# Altium schematic sheet AUV maincontrol.SchDoc
size A4; SheetNumber: 1; SheetTotal: 6
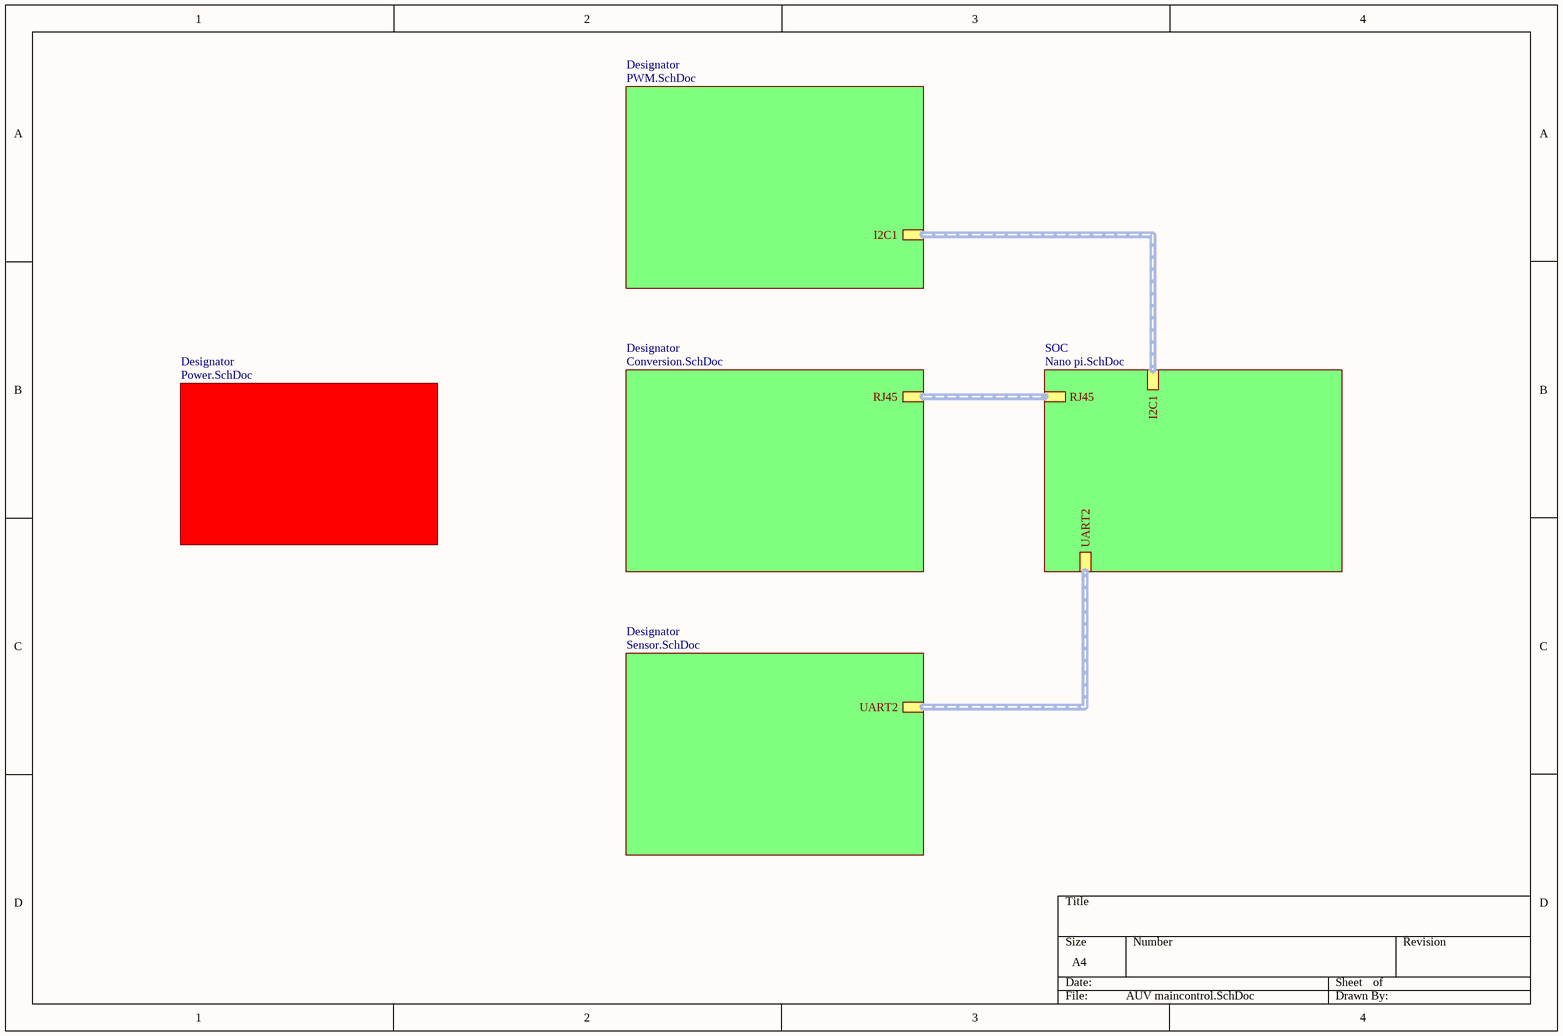
[diagram p0: AUV maincontrol.SchDoc]

## Sub-sheets
Designator = Power.SchDoc: no entries
Designator = Conversion.SchDoc: RJ45
Designator = PWM.SchDoc: I2C1
Designator = Sensor.SchDoc: UART2
SOC = Nano pi.SchDoc: RJ45, UART2, I2C1

## Buses and harness runs
harness sheet Designator/I2C1 = sheet SOC/I2C1
harness sheet Designator/RJ45 = sheet SOC/RJ45
harness sheet Designator/UART2 = sheet SOC/UART2